# EAGLE schematic boardv2ftdi (EAGLE 6.6.0)
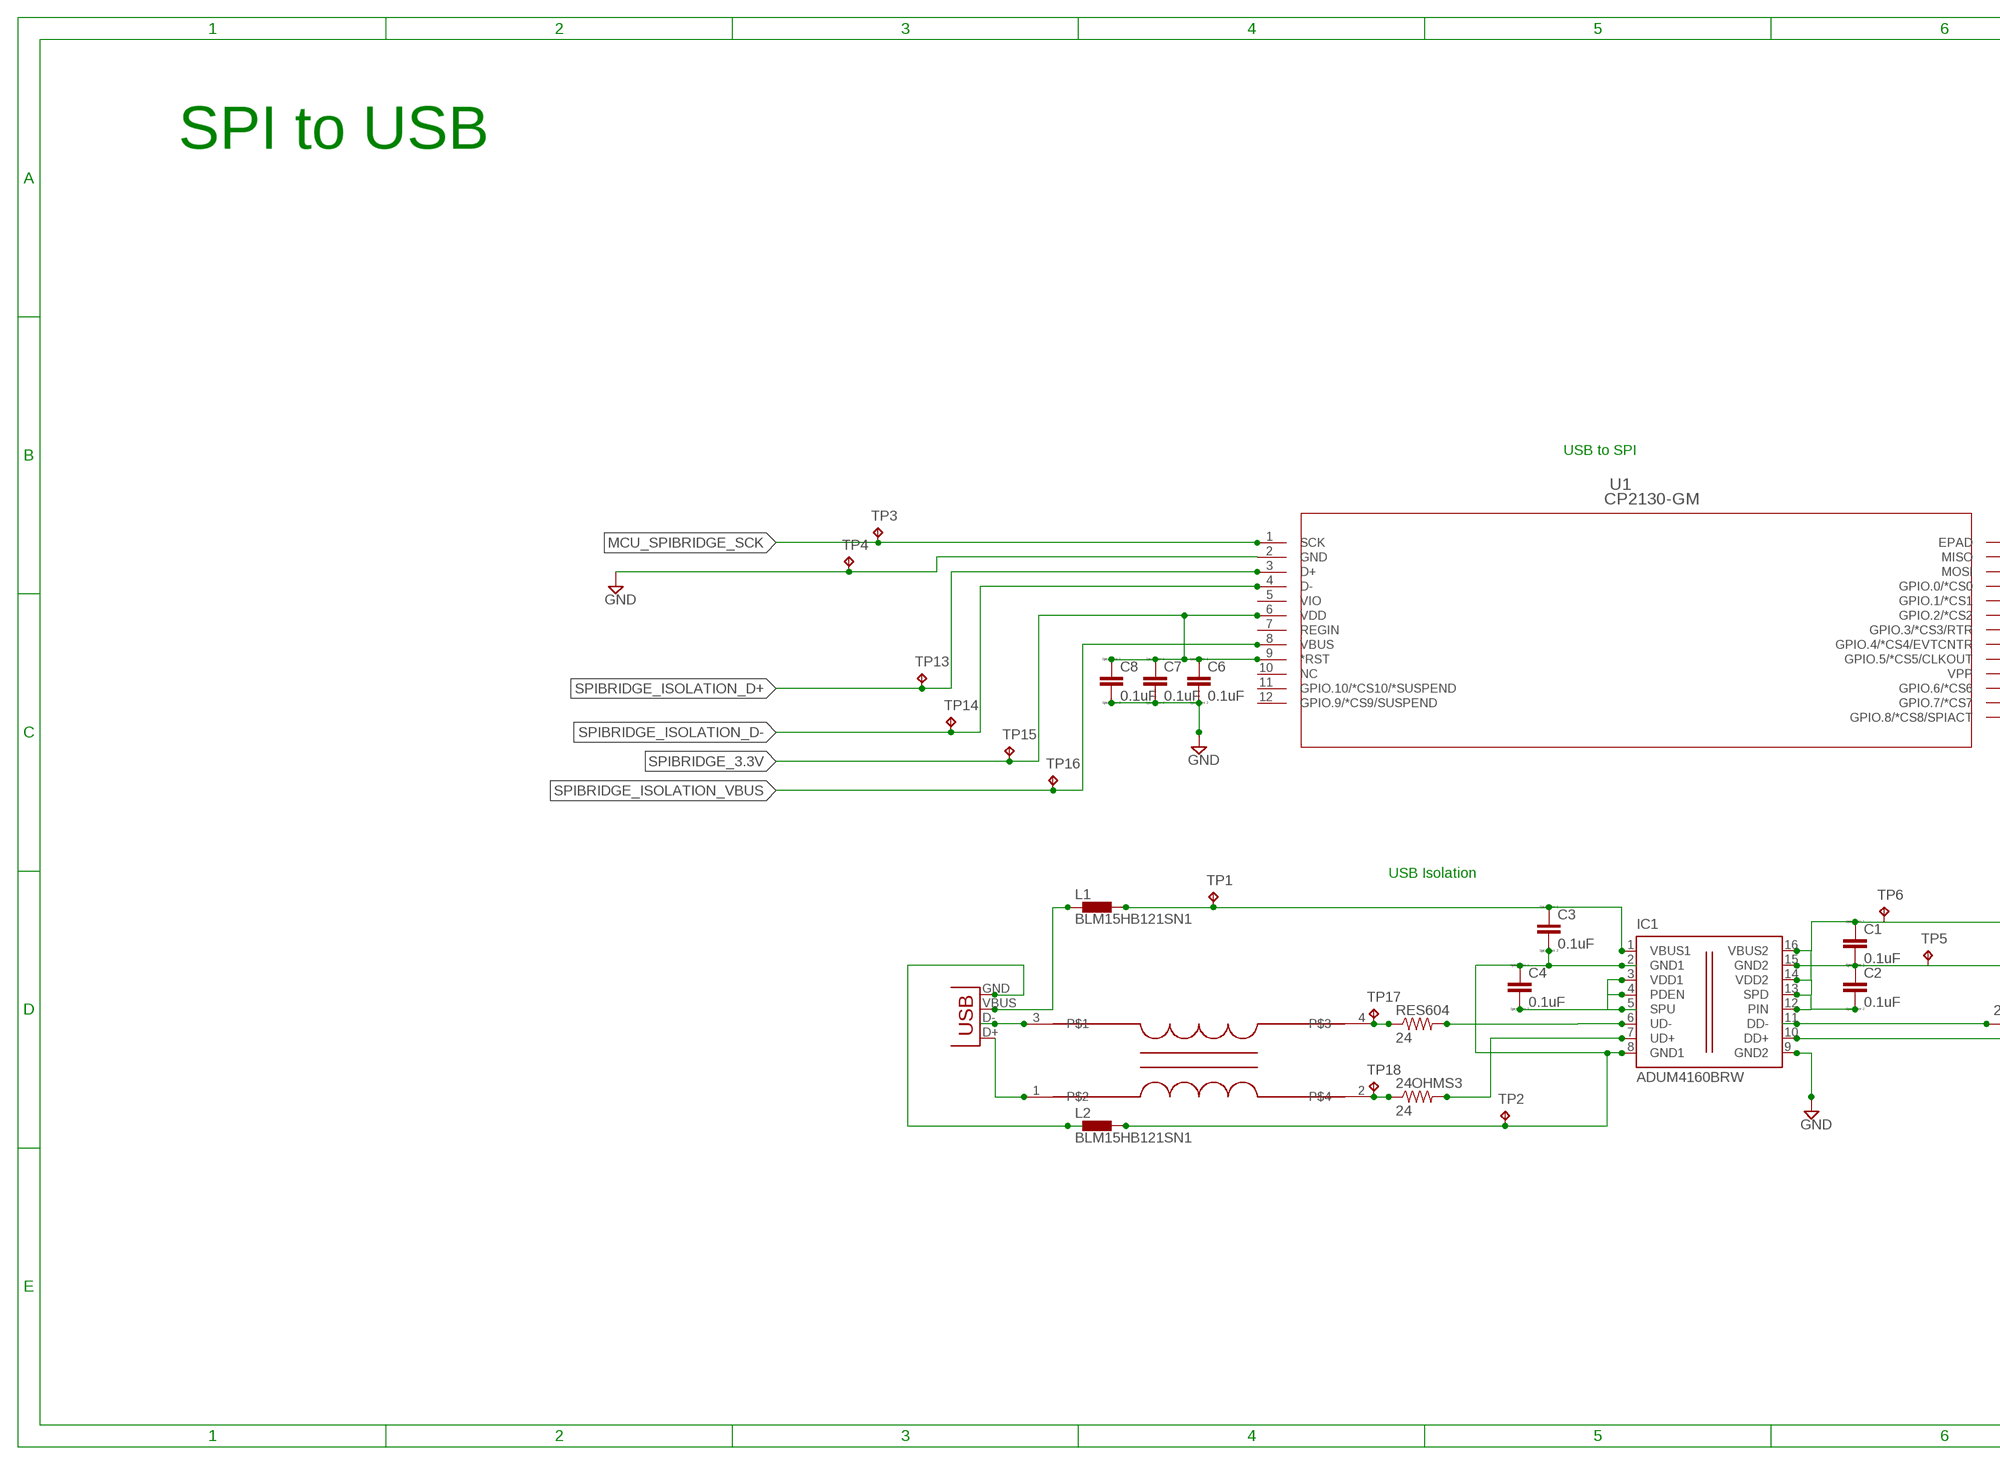
[diagram p0: schematic, sheet 1, part 1 of 2]
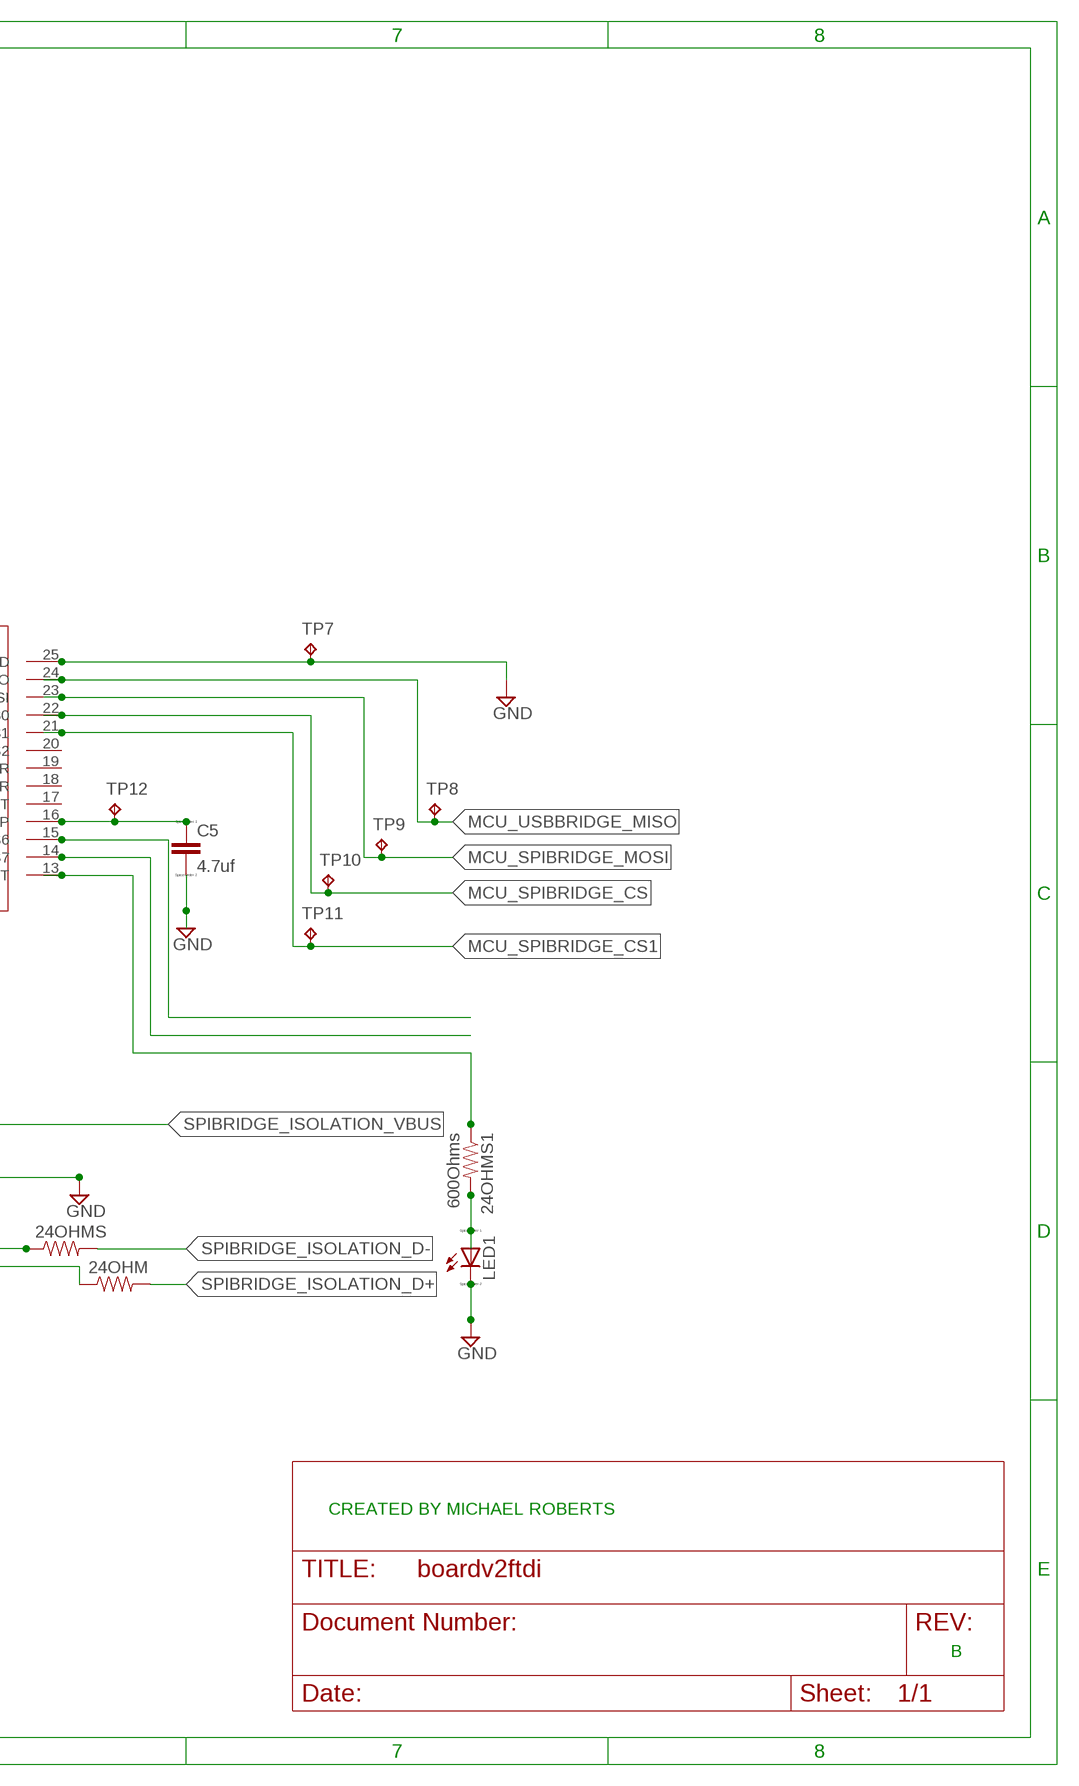
[diagram p1: schematic, sheet 1, part 2 of 2]

## Parts
24OHM  RESISTOR0603-RES  [0603-RES]
24OHMS  RESISTOR0603-RES  [0603-RES]
24OHMS1  600Ohms  RESISTOR0603-RES  [0603-RES]
24OHMS3  24  RESISTOR0603-RES  [0603-RES]
C1  0.1uF  CC0603  [C0603]
C2  0.1uF  CC0603  [C0603]
C3  0.1uF  CC0603  [C0603]
C4  0.1uF  CC0603  [C0603]
C5  4.7uf  CC0603  [C0603]
C6  0.1uF  CC0603  [C0603]
C7  0.1uF  CC0603  [C0603]
C8  0.1uF  CC0603  [C0603]
IC1  ADUM4160BRW  [SO16W]
JP1  USB-B  USBPTH  [USB-B-PTH]
L1  BLM15HB121SN1  [0402]
L2  BLM15HB121SN1  [0402]
LED1  LED_E  [LED_1206]
RES604  24  RESISTOR0603-RES  [0603-RES]
TP1  TPB1,27  [B1,27]
TP2  TPB1,27  [B1,27]
TP3  TPB1,27  [B1,27]
TP4  TPB1,27  [B1,27]
TP5  TPB1,27  [B1,27]
TP6  TPB1,27  [B1,27]
TP7  TPB1,27  [B1,27]
TP8  TPB2,54  [B2,54]
TP9  TPB2,54  [B2,54]
TP10  TPB2,54  [B2,54]
TP11  TPB2,54  [B2,54]
TP12  TPB1,27  [B1,27]
TP13  TPB1,27  [B1,27]
TP14  TPB1,27  [B1,27]
TP15  TPB1,27  [B1,27]
TP16  TPB1,27  [B1,27]
TP17  TPB2,54  [B2,54]
TP18  TPB2,54  [B2,54]
U1  CP2130-GM  [QFN24_4X4]
U$1  ACM3225-2P  [ACM3225-2P]

## Nets
GND: C1.2 C2.1 C5.2 C6.2 C7.2 C8.2 IC1.9(GND2) IC1.15(GND2) LED1.C TP4.TP TP5.TP TP7.TP U1.2(GND) U1.25(EPAD)
MCU_SPIBRIDGE_CS: TP10.TP
MCU_SPIBRIDGE_CS1: TP11.TP U1.21(GPIO.1/*CS1)
MCU_SPIBRIDGE_MOSI: TP9.TP U1.23(MOSI)
MCU_SPIBRIDGE_SCK: TP3.TP U1.1(SCK)
MCU_USBBRIDGE_MISO: TP8.TP U1.24(MISO)
N$1: RES604.1 TP17.TP U$1.4
N$2: 24OHMS3.2 IC1.7(UD+)
N$3: C3.2 C4.1 IC1.2(GND1) IC1.8(GND1) L2.2 TP2.TP
N$4: C3.1 IC1.1(VBUS1) L1.2 TP1.TP
N$5: JP1.D- U$1.3
N$6: 24OHM.1 IC1.10(DD+)
N$7: JP1.D+ U$1.1
N$8: 24OHMS.1 IC1.11(DD-)
N$9: JP1.GND L2.1
N$11: IC1.6(UD-) RES604.2
N$12: C4.2 IC1.3(VDD1) IC1.4(PDEN) IC1.5(SPU)
N$13: 24OHMS3.1 TP18.TP U$1.2
N$15: C5.1 TP12.TP U1.16(VPP)
N$16: U1.22(GPIO.0/*CS0)
N$18: JP1.VBUS L1.1
N$21: 24OHMS1.1 U1.13(GPIO.8/*CS8/SPIACT)
N$22: U1.14(GPIO.7/*CS7)
N$23: U1.15(GPIO.6/*CS6)
N$24: 24OHMS1.2 LED1.A
SPIBRIDGE_3.3V: C6.1 C7.1 C8.1 TP15.TP U1.6(VDD) U1.9(*RST)
SPIBRIDGE_ISOLATION_D+: 24OHM.2 TP13.TP U1.3(D+)
SPIBRIDGE_ISOLATION_D-: 24OHMS.2 TP14.TP U1.4(D-)
SPIBRIDGE_ISOLATION_VBUS: C1.1 C2.2 IC1.12(PIN) IC1.13(SPD) IC1.14(VDD2) IC1.16(VBUS2) TP6.TP TP16.TP U1.8(VBUS)
Unconnected: U1.5(VIO) U1.7(REGIN) U1.10(NC) U1.11(GPIO.10/*CS10/*SUSPEND) U1.12(GPIO.9/*CS9/SUSPEND) U1.17(GPIO.5/*CS5/CLKOUT) U1.18(GPIO.4/*CS4/EVTCNTR) U1.19(GPIO.3/*CS3/RTR) U1.20(GPIO.2/*CS2)

## Notes on the sheet
- SPI to USB
- USB to SPI
- USB Isolation
- CREATED BY MICHAEL ROBERTS
- B

## Library data of the parts
24OHM 24OHMS 24OHMS1 24OHMS3 RES604 = SparkFun-Passives:RESISTOR: Resistor Basic schematic elements and footprints for 0603, 1206, and PTH resistors.
C1-C8 = eagle-ltspice:C: CAPACITOR, European symbol; SPICEMODEL: NONE; SPICEPREFIX: C
IC1 = kblom:ADUM4160: Full/Low Speed 5 kV USB Digital Isolator Applications: USB peripheral isolation Isolated USB hub Medical applications source <http://www.analog.com/static/imported-files/data_sheets/ADuM4160.pdf> iso; FARNELL: 1858056
JP1 = SparkFun-Connectors:USB: USB Connectors USB-B-PTH is fully proven SKU : PRT-00139/CONN-08278 USB-miniB is fully proven SKU : PRT-00587 USB-A-PCB is untested. USB-A-H is throughly reviewed, but untested. Spark Fun Electronics SKU : PRT-00437 USB-B-SMT is throughly reviewed, but untested. Needs silkscreen touching up. USB-A-S has not been used/tested USB-MB-H has not been used/tested USB-MICROB has been used. CONN-09505; PROD_ID: CONN-08278
L1 L2 = inductors:BLM15H: EMIFIL (R) Chip Ferrite Bead for GHz Noise Source: http://www.murata.com/ Ferrite Bead BLM15H.pdf
LED1 = eagle-ltspice:LED_E: LED Source: http://www.osram.convergy.de Source: www.luxeon.com Source: www.kingbright.com; SPICEMODEL: NONE; SPICEPREFIX: D; SPICETYPE: diode
TP1-TP18 = testpad:TP: Test pad
U1 = shit:CP2130-GM; MANUFACTURER_PART_NUMBER: cp2130-gm; VENDOR: Silicon Labs
U$1 = shit:ACM3225-2P